# Altium schematic sheet Connection.SchDoc
size A4
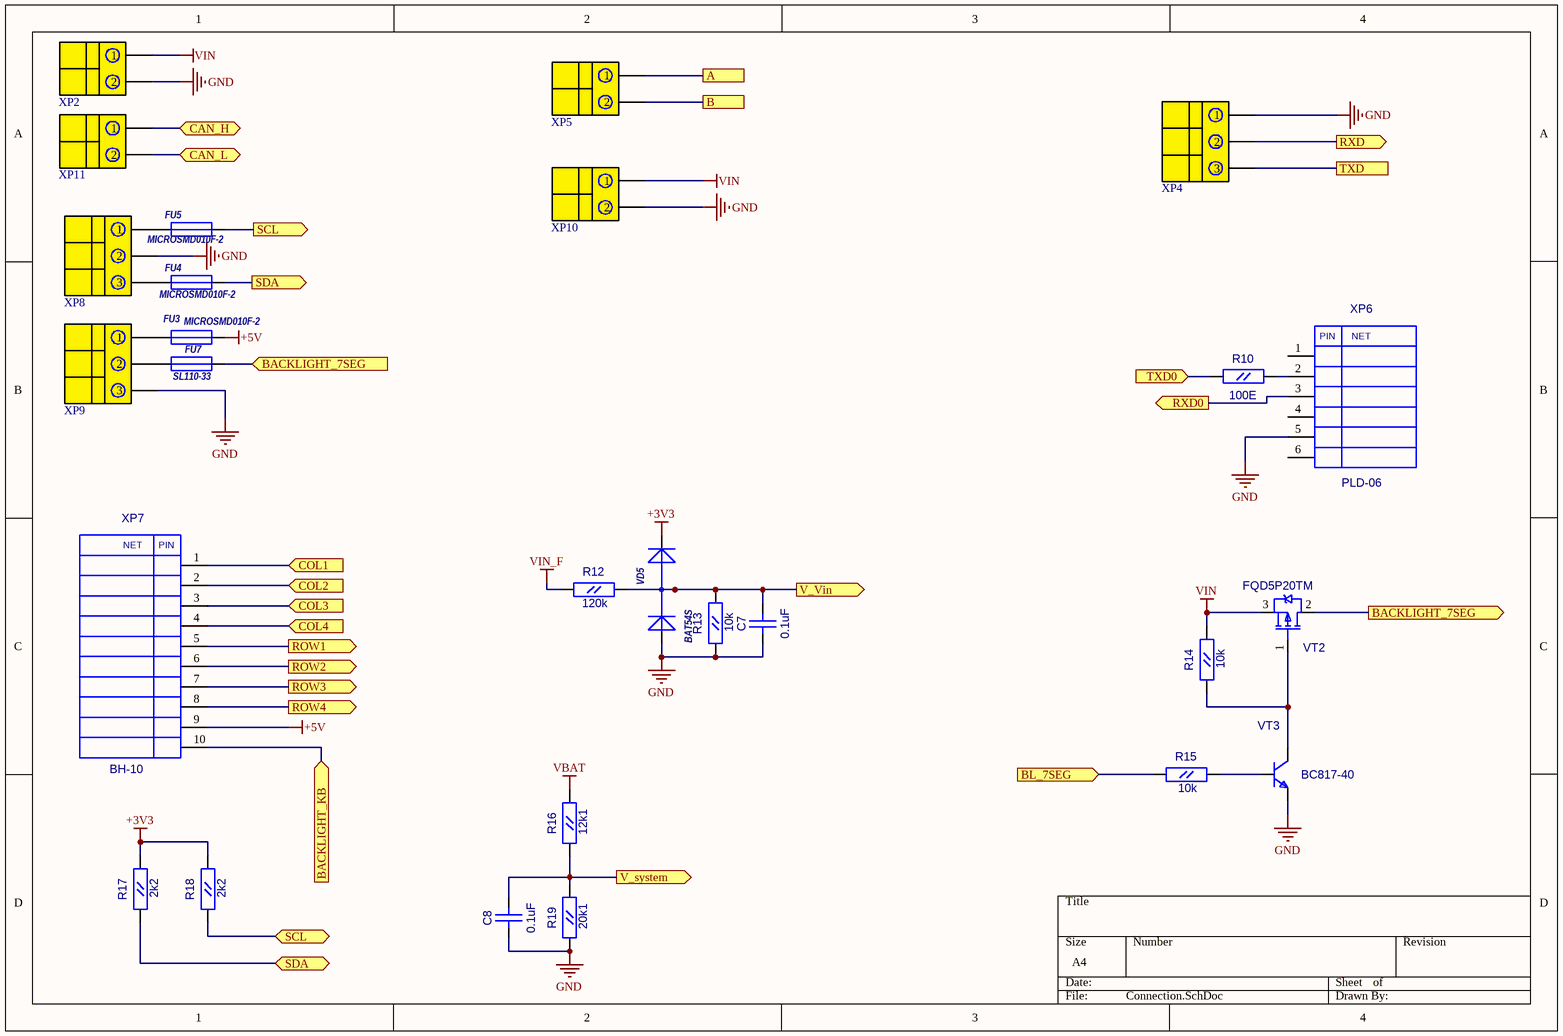
[diagram p0: Connection.SchDoc]

## Parts
C7  0.1uF  [CC0603]
C8  0.1uF  [CC0603]
FU3  MICROSMD010F-2  [RC1210]
FU4  MICROSMD010F-2  [RC1210]
FU5  MICROSMD010F-2  [RC1210]
FU7  SL110-33  [FSMD2920]
R10  100E  [RC0603]
R12  120k  [RC0603]
R13  10k  [RC0603]
R14  10k  [RC0603]
R15  10k  [RC0603]
R16  12k1  [RC0603]
R17  2k2  [RC0603]
R18  2k2  [RC0603]
R19  20k1  [RC0603]
VD5  BAT54S  [SOT-23(GSD)]
VT2  FQD5P20TM  [D-PAK(TO-252AA)]
VT3  BC817-40  [SOT-23(123)]
XP2  DG330-2PIN  [DG330-2PIN]  (value not drawn)
XP4  DG330-3P  [DG330-3PIN]  (value not drawn)
XP5  DG330-2PIN  [DG330-2PIN]  (value not drawn)
XP6  PLD-06  [PIN6]
XP7  BH-10  [BH-10]
XP8  DG330-3PIN  [DG330-3PIN]  (value not drawn)
XP9  DG330-3PIN  [DG330-3PIN]  (value not drawn)
XP10  DG330-2PIN  [DG330-2PIN]  (value not drawn)
XP11  DG330-2PIN  [DG330-2PIN]  (value not drawn)

## Ports
A, B, BACKLIGHT_7SEG (in), BACKLIGHT_7SEG (out), BACKLIGHT_KB (in), BL_7SEG (in), CAN_H (bidir), CAN_L (bidir), COL1 (in), COL2 (in), COL3 (in), COL4 (in), ROW1 (out), ROW2 (out), ROW3 (out), ROW4 (out), RXD0 (out), RXD (out), SCL (bidir), SCL (out), SDA (bidir), SDA (out), TXD, TXD0 (in), V_system (out), V_Vin (out)

## Nets
+3V3: R17.2(B) R18.2(B) VD5.2(K)
+5V: FU3.2 XP7.9
GND: C7.1(A) C8.1(A) R13.1(A) R19.1(A) VD5.1(A) VT3.2(E) XP2.2 XP4.1 XP6.5 XP8.2 XP9.3 XP10.2
VBAT: R16.2(B)
VIN: R14.2(B) VT2.3(S) XP2.1 XP10.1
VIN_F: R12.1(A)
A: XP5.1 ; port A
B: XP5.2 ; port B
BACKLIGHT_7SEG: FU7.2 VT2.2(D) ; port BACKLIGHT_7SEG
BACKLIGHT_KB: XP7.10 ; port BACKLIGHT_KB
BL_7SEG: R15.1(A) ; port BL_7SEG
CAN_H: XP11.1 ; port CAN_H
CAN_L: XP11.2 ; port CAN_L
COL1: XP7.1 ; port COL1
COL2: XP7.2 ; port COL2
COL3: XP7.3 ; port COL3
COL4: XP7.4 ; port COL4
ROW1: XP7.5 ; port ROW1
ROW2: XP7.6 ; port ROW2
ROW3: XP7.7 ; port ROW3
ROW4: XP7.8 ; port ROW4
RXD: XP4.2 ; port RXD
RXD0: XP6.3 ; port RXD0
SCL: FU5.2 R18.1(A) ; port SCL
SDA: FU4.2 R17.1(A) ; port SDA
TXD: XP4.3 ; port TXD
TXD0: R10.1(A) ; port TXD0
V_system: C8.2(B) R16.1(A) R19.2(B) ; port V_system
V_Vin: C7.2(B) R12.2(B) R13.2(B) VD5.3(AK) ; port V_Vin
NetFU3_1: FU3.1 XP9.1
NetFU4_1: FU4.1 XP8.3
NetFU5_1: FU5.1 XP8.1
NetFU7_1: FU7.1 XP9.2
NetR10_2: R10.2(B) XP6.2
NetR14_1: R14.1(A) VT2.1(G) VT3.3(C)
NetR15_2: R15.2(B) VT3.1(B)

Not connected (* = marked no-connect by the designer): XP6 1 4 6

## Notes on the sheet
- (in symbol BH-10) NET; PIN
- (in symbol PLD-06) PIN; NET

## Library data of the parts
C7 C8 = CC0603: Value: 0.1uF
FU3-FU5 = MICROSMD: Value: MICROSMD010F-2
FU7 = FSMD2920: FSMD150-2920; Value: *
R10 R12-R19 = RC0603
  R10: Value: 100E
  R12: Value: 120k
  R13-R15: Value: 10k
  R16: Value: 12k1
  R17 R18: Value: 2k2
  R19: Value: 20k1
VD5 = BAT54S: 1.0 Ampere General Purpose Rectifier; ComponentField6: Published 8-Jun-2000, Modified 11-July-2000: SIM Model Added.; Value: *
VT2 = IRFR9220: HEXFET Power MOSFET; OriginalName: IRLML5103; ComponentField7: Published 8-Jun-2000; Value: FQD5P20TM
VT3 = BC846BLT1: NPN 500ma transistor; ComponentField7: Published 29-Sep-2000; OriginalName: BC846BLT1; Value: BC817-40
XP4 = DG330-3PIN: Value: DG330-3P
XP6 = PLD-06: PLD06; Value: *
XP2 XP5 XP10 XP11 = DG330-2PIN: Value: DG330-2PIN
XP7 = BH-10: Value: *
XP8 XP9 = DG330-3PIN: Value: DG330-3PIN